# Altium schematic sheet PROC099A_LC_Filtering_Reference.SchDoc
size 431 x 279 mm; Date: Not shown in title block; ApprovedBy: Not shown in title block; CheckedBy: Not shown in title block; Author: Not shown in title block; CompanyName: Not shown in title block; DrawnBy: Adrian Ozer; Engineer: Not shown in title block; Organization: Not shown in title block; Address1: Not shown in title block; Address2: Not shown in title block; Address3: Not shown in title block; Address4: Not shown in title block; DocumentNumber: 5; Revision: Use project parameter SCH_Rev; SheetNumber: 5; SheetTotal: 16; PageSetup: Record=PageOptions|CenterHorizontal=True|CenterVertical=True|PrintScale=1.00|XCorrection=1.00|YCorrection=1.00|PrintKind=0|BorderSize=5000000|LeftOffset=0|BottomOffset=0|Orientation=2|PaperLength=1000|PaperWidth=1000|Scale=100|PaperSource=15|PrintQuality=600|MediaType=1|DitherType=10|PaperKind=Letter|PrintScaleMode=1; CurrentTime: Not shown in title block; CurrentDate: Not shown in title block; Time: Not shown in title block; DocumentFullPathAndName: Not shown in title block; DocumentName: Not shown in title block; ModifiedDate: Not shown in title block; ImagePath: Not shown in title block
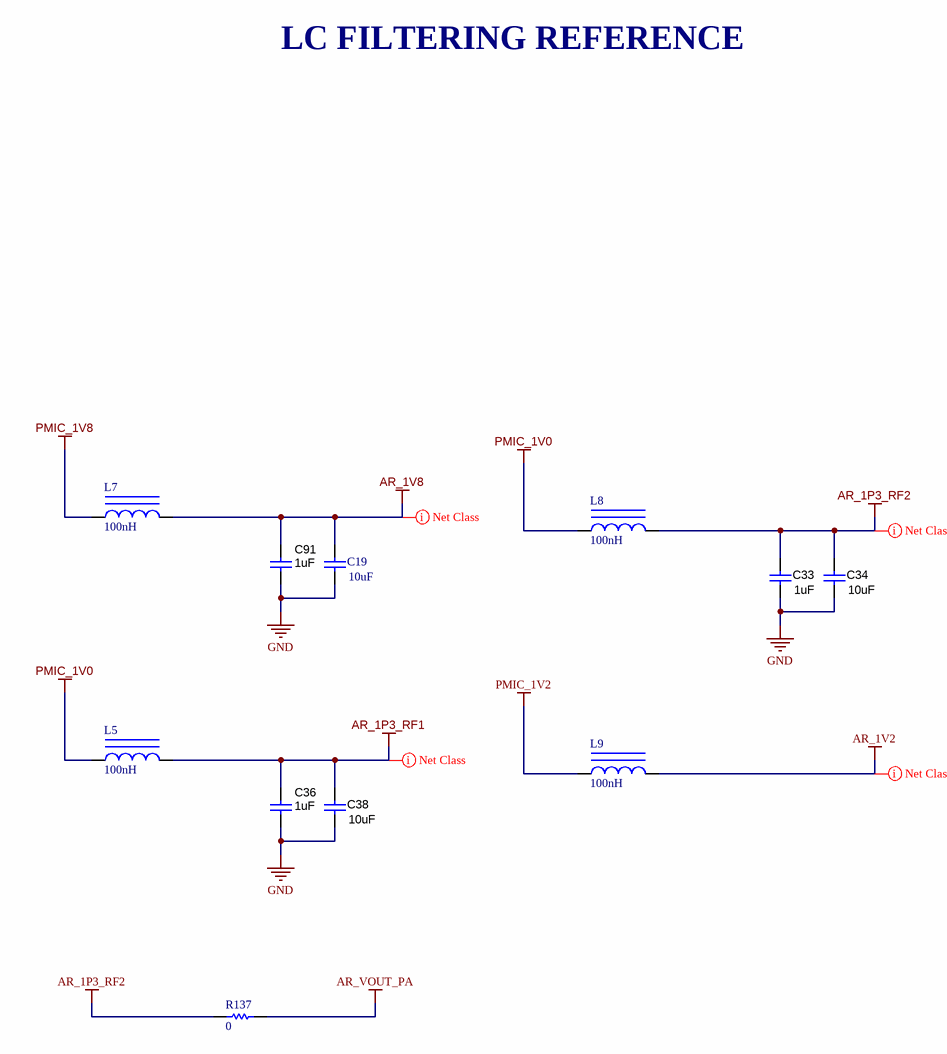
[diagram p0: PROC099A_LC_Filtering_Reference.SchDoc]

## Parts
C19  ValueDisplayed: 10uF  [0805_HV]  (hidden comment: GCM21BR71A106KE22L)
C33  ValueDisplayed: 1uF  [0603]  (hidden comment: GCM188R71C105KA64D)
C34  ValueDisplayed: 10uF  [0805_HV]  (hidden comment: GCM21BR71A106KE22L)
C36  ValueDisplayed: 1uF  [0603]  (hidden comment: GCM188R71C105KA64D)
C38  ValueDisplayed: 10uF  [0805_HV]  (hidden comment: GCM21BR71A106KE22L)
C91  ValueDisplayed: 1uF  [0603]  (hidden comment: GCM188R71C105KA64D)
L5  ValueDisplayed: 100nH  [NLCV32]  (hidden comment: NLCV32T-R10M-EFRD)
L7  ValueDisplayed: 100nH  [NLCV32]  (hidden comment: NLCV32T-R10M-EFRD)
L8  ValueDisplayed: 100nH  [NLCV32]  (hidden comment: NLCV32T-R10M-EFRD)
L9  ValueDisplayed: 100nH  [NLCV32]  (hidden comment: NLCV32T-R10M-EFRD)
R137  ValueDisplayed: 0  [0603]  (hidden comment: MCT06030Z0000ZP500)

## Nets
AR_1P3_RF1: C36.2 C38.2 L5.2
AR_1P3_RF2: C33.2 C34.2 L8.2 R137.1
AR_1V2: L9.2
AR_1V8: C19.1 C91.2 L7.2
AR_VOUT_PA: R137.2
GND: C19.2 C33.1 C34.1 C36.1 C38.1 C91.1
PMIC_1V0: L5.1 L8.1
PMIC_1V2: L9.1
PMIC_1V8: L7.1

## Layout directives
net class PWR: AR_1P3_RF1, AR_1P3_RF2, AR_1V2, AR_1V8

## Notes on the sheet
- LC FILTERING REFERENCE
- Drawn By:
- SVN Rev:
- Number:
- TID #:
- Orderable:
- Rev:
- Sheet Title:
- File:
- Project Title:
- Designed for:
- Assembly Variant:
- Mod. Date:
- Sheet:
- Size:
- of
- B
- http://www.ti.com
- Texas Instruments and/or its licensors do not warrant the accuracy or completeness of this specification or any information contained therein. Texas Instruments and/or its licensors do not warrant that this design will meet the specifications, will be suitable for your application or fit for any particular purpose, or will operate in an implementation. Texas Instruments and/or its licensors do not warrant that the design is production worthy. You should completely validate and test your design implementation to confirm the system functionality for your application.
- Engineer:
- Contact:
- © Texas Instruments

## Library data of the parts
C19 = CMP-0008017-2: CAP, CERM, 10 uF, 10 V, +/- 10%, X7R, 0805; Manufacturer: MuRata; TaMin_C: -55°C; Polarized: N; SizeAreaWB_mm2: 6.75; Value1: Unknown; U/M: EA; Value: 10uF; TaMax_C: 125°C; SizeZ_mm: 1.45; SizeX_mm: 2; SizeY_mm: 1.25; Cap_Case: 0805; Value2: 10V; SizeArea_mm2: 2.5; Cap_F: 10µF; AEC Category: Q200; Supplier Part Number 2: 06AC6014; Publisher: Texas Instruments; Supplier 2: Newark; Supplier Part Number 3: 81-GCM21BR71A106KE2L; TempCo: X7R; Supplier 3: Mouser; Published: 2008-06-19; RoHS: Y; MountType: SMT; Supplier 1: Digi-Key; PackageReference: 0805; Tolerance_%: 10%; CompType: Capacitor; LatestRevisionDate: 2017-03-09; PartNumber: GCM21BR71A106KE22L; AEC Qualified: ?; VDC_V: 10V; ComponentLink1Description: Datasheet link; Supplier Part Number 1: 490-10674-1-ND; Technology: Ceramic; ComponentLink1URL: http://www.murata.com/products/catalog/pdf/c03e.pdf
C33 C36 C91 = CMP-0007136-5: CAP, CERM, 1 uF, 16 V, +/- 10%, X7R, AEC-Q200 Grade 1, 0603; Manufacturer: MuRata; TaMin_C: -55°C; Polarized: N; SizeAreaWB_mm2: 4.68; Value1: Unknown; U/M: EA; Value: 1uF; TaMax_C: 125°C; SizeZ_mm: 1; SizeX_mm: 1.6; SizeY_mm: 0.8; Value2: 16V; SizeArea_mm2: 1.28; AEC Qualified: Y; Cap_F: 1µF; AEC Category: Q200; Supplier Part Number 2: 81-GCM188R71C105K64D; Publisher: Texas Instruments; Supplier 2: Mouser; TempCo: X7R; Published: 2008-06-19; RoHS: Y; MountType: SMT; Supplier 1: Digi-Key; PackageReference: 0603; Tolerance_%: 10%; Cap_Case: 0603; CompType: Capacitor; LatestRevisionDate: 2017-03-09; PartNumber: GCM188R71C105KA64D; VDC_V: 16V; ComponentLink1Description: Datasheet link; AEC Grade: 1; Supplier Part Number 1: 490-5241-6-ND; Technology: Ceramic; ComponentLink1URL: http://psearch.en.murata.com/capacitor/product/GCM188R71C105KA64%23.pdf
C34 C38 = CMP-0008017-2: CAP, CERM, 10 uF, 10 V, +/- 10%, X7R, 0805; Manufacturer: MuRata; TaMin_C: -55°C; Polarized: N; SizeAreaWB_mm2: 6.75; Value1: Unknown; U/M: EA; Value: 10uF; TaMax_C: 125°C; SizeZ_mm: 1.45; SizeX_mm: 2; SizeY_mm: 1.25; Cap_Case: 0805; Value2: 10V; SizeArea_mm2: 2.5; CompType: Capacitor; Cap_F: 10µF; AEC Category: Q200; Supplier Part Number 2: 06AC6014; Publisher: Texas Instruments; Supplier 2: Newark; Supplier Part Number 3: 81-GCM21BR71A106KE2L; TempCo: X7R; Supplier 3: Mouser; Published: 2008-06-19; RoHS: Y; MountType: SMT; Supplier 1: Digi-Key; PackageReference: 0805; Tolerance_%: 10%; LatestRevisionDate: 2017-03-09; PartNumber: GCM21BR71A106KE22L; AEC Qualified: ?; VDC_V: 10V; ComponentLink1Description: Datasheet link; Supplier Part Number 1: 490-10674-1-ND; Technology: Ceramic; ComponentLink1URL: http://www.murata.com/products/catalog/pdf/c03e.pdf
L5 L7-L9 = CMP-0083745-1: Inductor, Wirewound, Ferrite, 100 nH, 2.85 A, 0.024 ohm, AEC-Q200 Grade 1, SMD; Manufacturer: TDK; Isat: 2.85A @ 10% inductance drop; Irms: 2.85A @ 40C rise; SizeAreaWB_mm2: 13.44; DCR_ohm: 0.024; Value: 100nH; Imax_A: 2.85A; SizeZ_mm: 2.5; SizeX_mm: 3.2; SizeY_mm: 2.2; SizeArea_mm2: 7.04; AEC Qualified: Y; AEC Grade: 1; AEC Category: Q200; ComponentLink1URL: https://product.tdk.com/info/en/catalog/datasheets/inductor_automotive_decoupling_nlcv32-efrd_en.pdf; RoHS: Y; Value1: 0.024 ohm; Material: Ferrite; MountType: SMT; PackageReference: 3.2x2.2x2.5mm; Value2: 2.85A; CompType: Inductor; Ind_H: 100nH; PartNumber: NLCV32T-R10M-EFRD; ComponentLink1Description: Datasheet link; Technology: Wirewound
R137 = CMP-0025884-3: RES, 0, 5%, 0.125 W, 0603; Manufacturer: Vishay/Beyschlag; Power_W: 125mW; TempCo: ppm/C; Value_Code: 0000; U/M: EA; Value: 0; EIA_Code: E24; SizeX_mm: 1.6; SizeY_mm: 0.8; SizeZ_mm: 1; Value2: 0.125W; SizeArea_mm2: 1.28; CompType: Resistor; AEC Qualified: N; AEC Category: Q200; Supplier Part Number 2: 96Y9454; Publisher: Texas Instruments; Supplier 2: Newark; Supplier Part Number 3: 594-MCT06030Z0000ZP5; Supplier 3: Mouser; Published: 2008-06-26; RoHS: Y; Value1: 5%; MountType: SMT; Supplier 1: Digi-Key; PackageReference: 0603; Tolerance_%: 5%; Res_ohm: 0; LatestRevisionDate: 2017-03-09; PartNumber: MCT06030Z0000ZP500; ComponentLink1Description: Datasheet link; AEC Grade: N/A; Supplier Part Number 1: MCT0603-0.0-ZZCT-ND; Technology: Thin Film; ComponentLink1URL: http://www.vishay.com/docs/28705/mcx0x0xpro.pdf